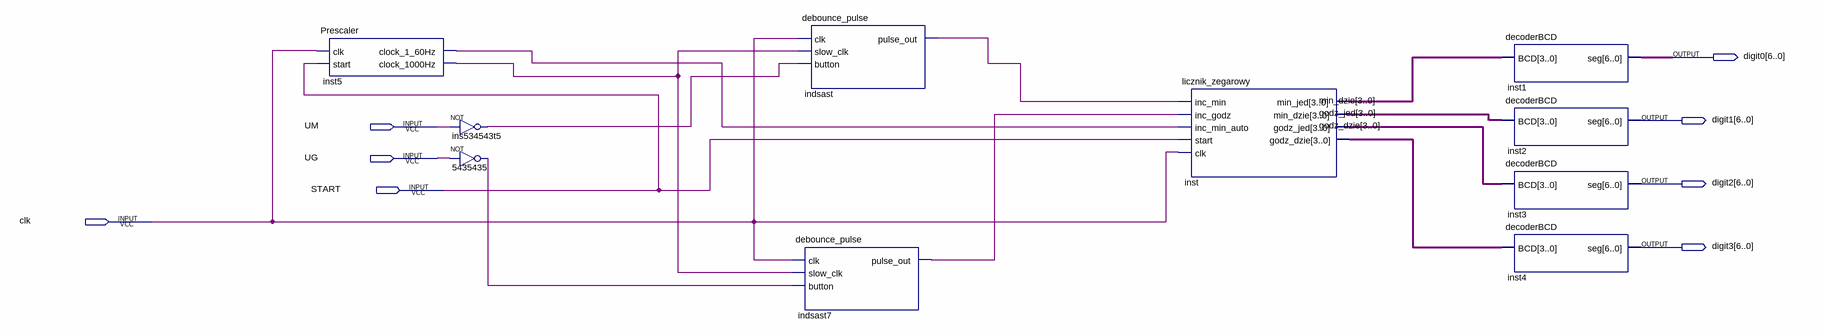
[diagram p0: schematic sheet]
// Quartus schematic test.bdf as structural Verilog: 10 symbols, 8 pins
module test (
  input  UM,
  input  UG,
  input  START,
  input  clk,
  output [6:0] digit0,
  output [6:0] digit1,
  output [6:0] digit2,
  output [6:0] digit3
);

  wire indsast7_pulse_out, indsast_pulse_out, ins534543t5_out, inst5_clock_1_60hz, inst5_clock_1000hz,
       n5435435_out;
  wire [3:0] godz_dzie, godz_jed, inst_min_jed, min_dzie;

  Prescaler inst5 (.clk(clk), .start(START), .clock_1_60Hz(inst5_clock_1_60hz), .clock_1000Hz(inst5_clock_1000hz));
  not ins534543t5 (ins534543t5_out, UM);
  not u_5435435 (n5435435_out, UG);
  debounce_pulse indsast (
    .clk(clk), .slow_clk(inst5_clock_1000hz), .button(ins534543t5_out), .pulse_out(indsast_pulse_out));
  debounce_pulse indsast7 (
    .clk(clk), .slow_clk(inst5_clock_1000hz), .button(n5435435_out), .pulse_out(indsast7_pulse_out));
  licznik_zegarowy inst (
    .inc_min(indsast_pulse_out), .inc_godz(indsast7_pulse_out), .inc_min_auto(inst5_clock_1_60hz),
    .start(START), .clk(clk), .min_jed(inst_min_jed), .min_dzie(min_dzie), .godz_jed(godz_jed),
    .godz_dzie(godz_dzie));
  decoderBCD inst1 (.BCD(inst_min_jed), .seg(digit0));
  decoderBCD inst2 (.BCD(min_dzie), .seg(digit1));
  decoderBCD inst3 (.BCD(godz_jed), .seg(digit2));
  decoderBCD inst4 (.BCD(godz_dzie), .seg(digit3));
endmodule
